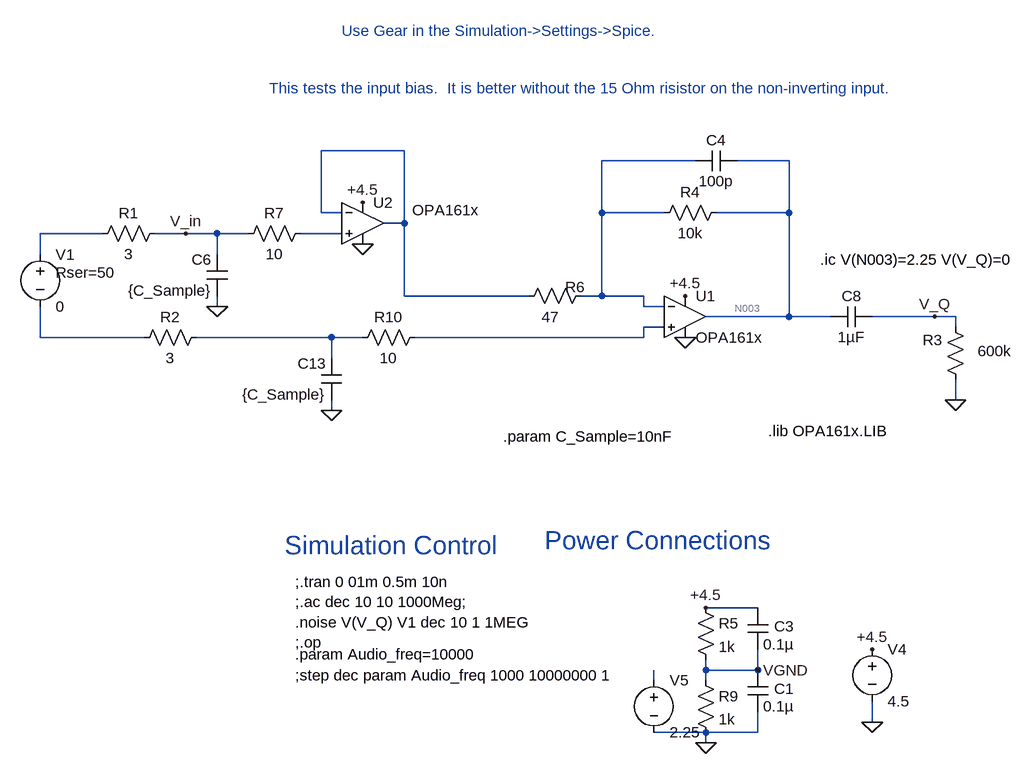
[diagram p0: schematic Noise Amplifier_Balanced_2026._OPA161x.asc]
Noise Amplifier_Balanced_2026._OPA161x.asc, the LTspice schematic file:
Version 4.1
SHEET 1 4032 1748
WIRE 608 -224 480 -224
WIRE 1056 -208 912 -208
WIRE 1200 -208 1120 -208
WIRE 480 -128 480 -224
WIRE 512 -128 480 -128
WIRE 912 -128 912 -208
WIRE 1008 -128 912 -128
WIRE 1200 -128 1200 -208
WIRE 1200 -128 1088 -128
WIRE 608 -112 608 -224
WIRE 608 -112 576 -112
WIRE 144 -96 48 -96
WIRE 272 -96 224 -96
WIRE 320 -96 272 -96
WIRE 368 -96 320 -96
WIRE 512 -96 448 -96
WIRE 48 -64 48 -96
WIRE 320 -64 320 -96
WIRE 608 0 608 -112
WIRE 800 0 608 0
WIRE 912 0 912 -128
WIRE 912 0 880 0
WIRE 976 0 912 0
WIRE 320 16 320 0
WIRE 976 16 976 0
WIRE 1008 16 976 16
WIRE 1200 32 1200 -128
WIRE 1200 32 1072 32
WIRE 1264 32 1200 32
WIRE 1424 32 1328 32
WIRE 1456 32 1424 32
WIRE 1008 48 976 48
WIRE 1456 48 1456 32
WIRE 48 64 48 16
WIRE 208 64 48 64
WIRE 496 64 288 64
WIRE 544 64 496 64
WIRE 976 64 976 48
WIRE 976 64 624 64
WIRE 496 96 496 64
WIRE 1456 160 1456 128
WIRE 496 176 496 160
WIRE 1152 480 1072 480
WIRE 1072 576 1072 560
WIRE 1152 576 1152 544
WIRE 1152 576 1072 576
WIRE 992 592 992 576
WIRE 1072 592 1072 576
WIRE 1328 656 1328 624
WIRE 1072 672 992 672
WIRE 1152 672 1152 640
WIRE 1152 672 1072 672
WIRE 1072 688 1072 672
FLAG 1328 544 +4.5
FLAG 1328 656 0
FLAG 1152 576 VGND
FLAG 496 176 0
FLAG 1424 32 V_Q
FLAG 1040 64 0
FLAG 1072 688 0
FLAG 1072 480 +4.5
FLAG 1040 0 +4.5
FLAG 544 -80 0
FLAG 544 -144 +4.5
FLAG 320 16 0
FLAG 1456 160 0
FLAG 272 -96 V_in
DATAFLAG 992 576 ""
SYMBOL voltage 1328 528 R0
WINDOW 123 0 0 Left 0
WINDOW 39 0 0 Left 0
SYMATTR InstName V4
SYMATTR Value 4.5
SYMBOL cap 512 160 R180
WINDOW 0 24 56 Left 2
WINDOW 3 24 8 Left 2
SYMATTR InstName C13
SYMATTR Value {C_Sample}
SYMBOL res 896 -16 R90
WINDOW 0 18 25 VBottom 2
WINDOW 3 33 63 VTop 2
SYMATTR InstName R6
SYMATTR Value 47
SYMBOL cap 1120 -224 R90
WINDOW 0 0 32 VBottom 2
WINDOW 3 32 32 VTop 2
SYMATTR InstName C4
SYMATTR Value 100p
SYMBOL res 1056 464 R0
SYMATTR InstName R5
SYMATTR Value 1k
SYMBOL res 1056 576 R0
SYMATTR InstName R9
SYMATTR Value 1k
SYMBOL cap 1136 576 R0
WINDOW 0 41 29 Left 2
SYMATTR InstName C1
SYMATTR Value 0.1µ
SYMBOL cap 1136 480 R0
WINDOW 0 41 29 Left 2
SYMATTR InstName C3
SYMATTR Value 0.1µ
SYMBOL cap 336 0 R180
WINDOW 0 24 56 Left 2
WINDOW 3 24 8 Left 2
SYMATTR InstName C6
SYMATTR Value {C_Sample}
SYMBOL res 1472 144 R180
WINDOW 0 36 76 Left 2
WINDOW 3 -71 59 Left 2
SYMATTR InstName R3
SYMATTR Value 600k
SYMBOL cap 1328 16 R90
WINDOW 0 0 32 VBottom 2
WINDOW 3 32 32 VTop 2
SYMATTR InstName C8
SYMATTR Value 1µF
SYMBOL OpAmps\\opamp2 1040 -32 R0
SYMATTR InstName U1
SYMATTR Value OPA161x
SYMBOL OpAmps\\opamp2 544 -176 R0
WINDOW 3 76 44 Left 2
SYMATTR Value OPA161x
SYMATTR InstName U2
SYMBOL res 1104 -144 R90
WINDOW 0 0 56 VBottom 2
WINDOW 3 32 56 VTop 2
SYMATTR InstName R4
SYMATTR Value 10k
SYMBOL voltage 992 576 R0
WINDOW 123 0 0 Left 0
WINDOW 39 0 0 Left 0
SYMATTR InstName V5
SYMATTR Value 2.25
SYMBOL voltage 48 -80 R0
WINDOW 123 0 0 Left 0
WINDOW 39 24 44 Left 2
SYMATTR InstName V1
SYMATTR Value 0
SYMATTR SpiceLine Rser=50
SYMBOL res 240 -112 R90
WINDOW 0 0 56 VBottom 2
WINDOW 3 32 56 VTop 2
SYMATTR InstName R1
SYMATTR Value 3
SYMBOL res 304 48 R90
WINDOW 0 0 56 VBottom 2
WINDOW 3 32 56 VTop 2
SYMATTR InstName R2
SYMATTR Value 3
SYMBOL res 464 -112 R90
WINDOW 0 0 56 VBottom 2
WINDOW 3 32 56 VTop 2
SYMATTR InstName R7
SYMATTR Value 10
SYMBOL res 640 48 R90
WINDOW 0 0 56 VBottom 2
WINDOW 3 32 56 VTop 2
SYMATTR InstName R10
SYMATTR Value 10
TEXT 440 440 Left 2 !;.tran 0 01m 0.5m 10n\n;.ac dec 10 10 1000Meg;\n.noise V(V_Q) V1 dec 10 1 1MEG\n;.op
TEXT 824 376 Left 4 ;Power Connections
TEXT 424 384 Left 4 ;Simulation Control
TEXT 440 584 Left 2 !;step dec param Audio_freq 1000 10000000 1
TEXT 440 552 Left 2 !.param Audio_freq=10000
TEXT 400 -320 Left 2 ;This tests the input bias.  It is better without the 15 Ohm risistor on the non-inverting input.
TEXT 1248 -56 Left 2 !.ic V(N003)=2.25 V(V_Q)=0
TEXT 1168 208 Left 2 !.lib OPA161x.LIB
TEXT 512 -408 Left 2 ;Use Gear in the Simulation->Settings->Spice.
TEXT 760 216 Left 2 !.param C_Sample=10nF

The netlist it stands for:
* Noise Amplifier_Balanced_2026._OPA161x.asc
V4 +4.5 0 4.5
C13 0 N008 {C_Sample}
R6 N002 N001 47
C4 N003 N002 100p
R5 +4.5 VGND 1k
R9 VGND 0 1k
C1 VGND 0 0.1µ
C3 +4.5 VGND 0.1µ
C6 0 V_in {C_Sample}
R3 0 V_Q 600k
C8 V_Q N003 1µF
X§U1 N006 N002 +4.5 0 N003 OPA161x  ; pins In+ In- V+ V- OUT
X§U2 N005 N001 +4.5 0 N001 OPA161x  ; pins In+ In- V+ V- OUT
R4 N003 N002 10k
V5 N009 0 2.25
V1 N004 N007 0 Rser=50
R1 V_in N004 3
R2 N008 N007 3
R7 N005 V_in 10
R10 N006 N008 10
;.tran 0 01m 0.5m 10n
;.ac dec 10 10 1000Meg;
.noise V(V_Q) V1 dec 10 1 1MEG
;.op
* Power Connections
* Simulation Control
;step dec param Audio_freq 1000 10000000 1
.param Audio_freq=10000
* This tests the input bias.  It is better without the 15 Ohm risistor on the non-inverting input.
.ic V(N003)=2.25 V(V_Q)=0
.lib OPA161x.LIB
* Use Gear in the Simulation->Settings->Spice.
.param C_Sample=10nF
.backanno
.end